# EAGLE schematic M462B Final (EAGLE 7.2.0)
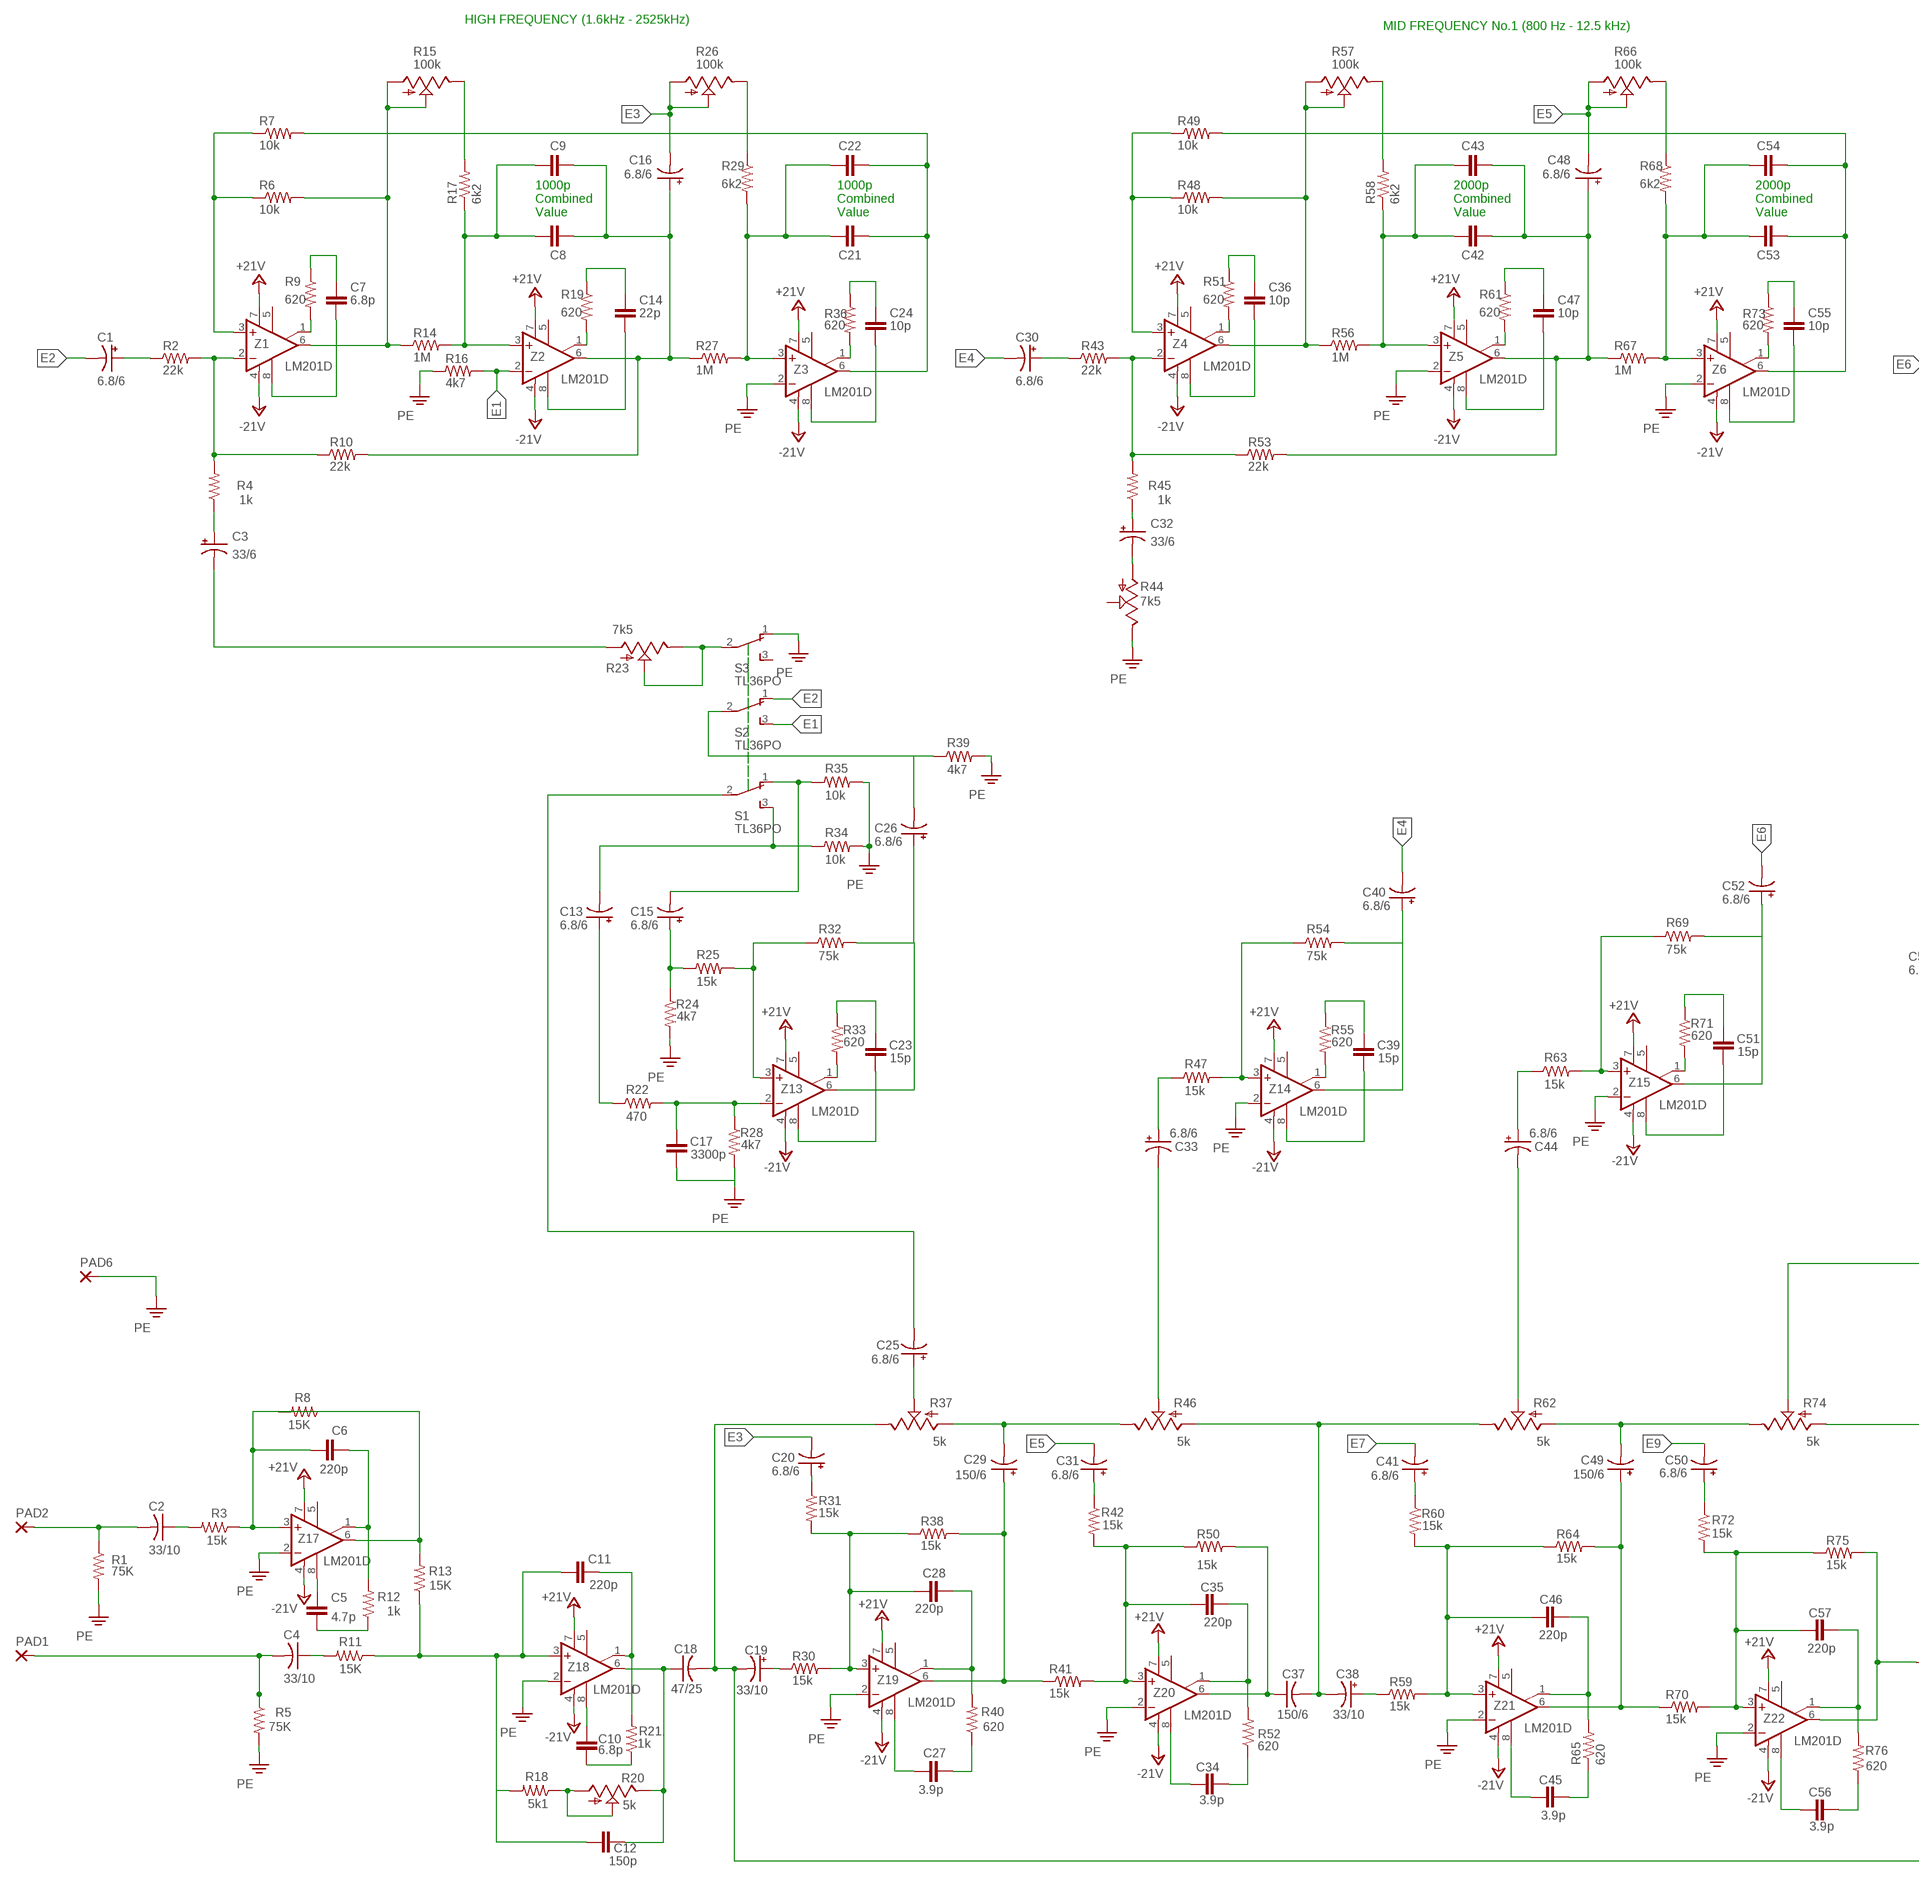
[diagram p0: schematic, sheet 1, part 1 of 2]
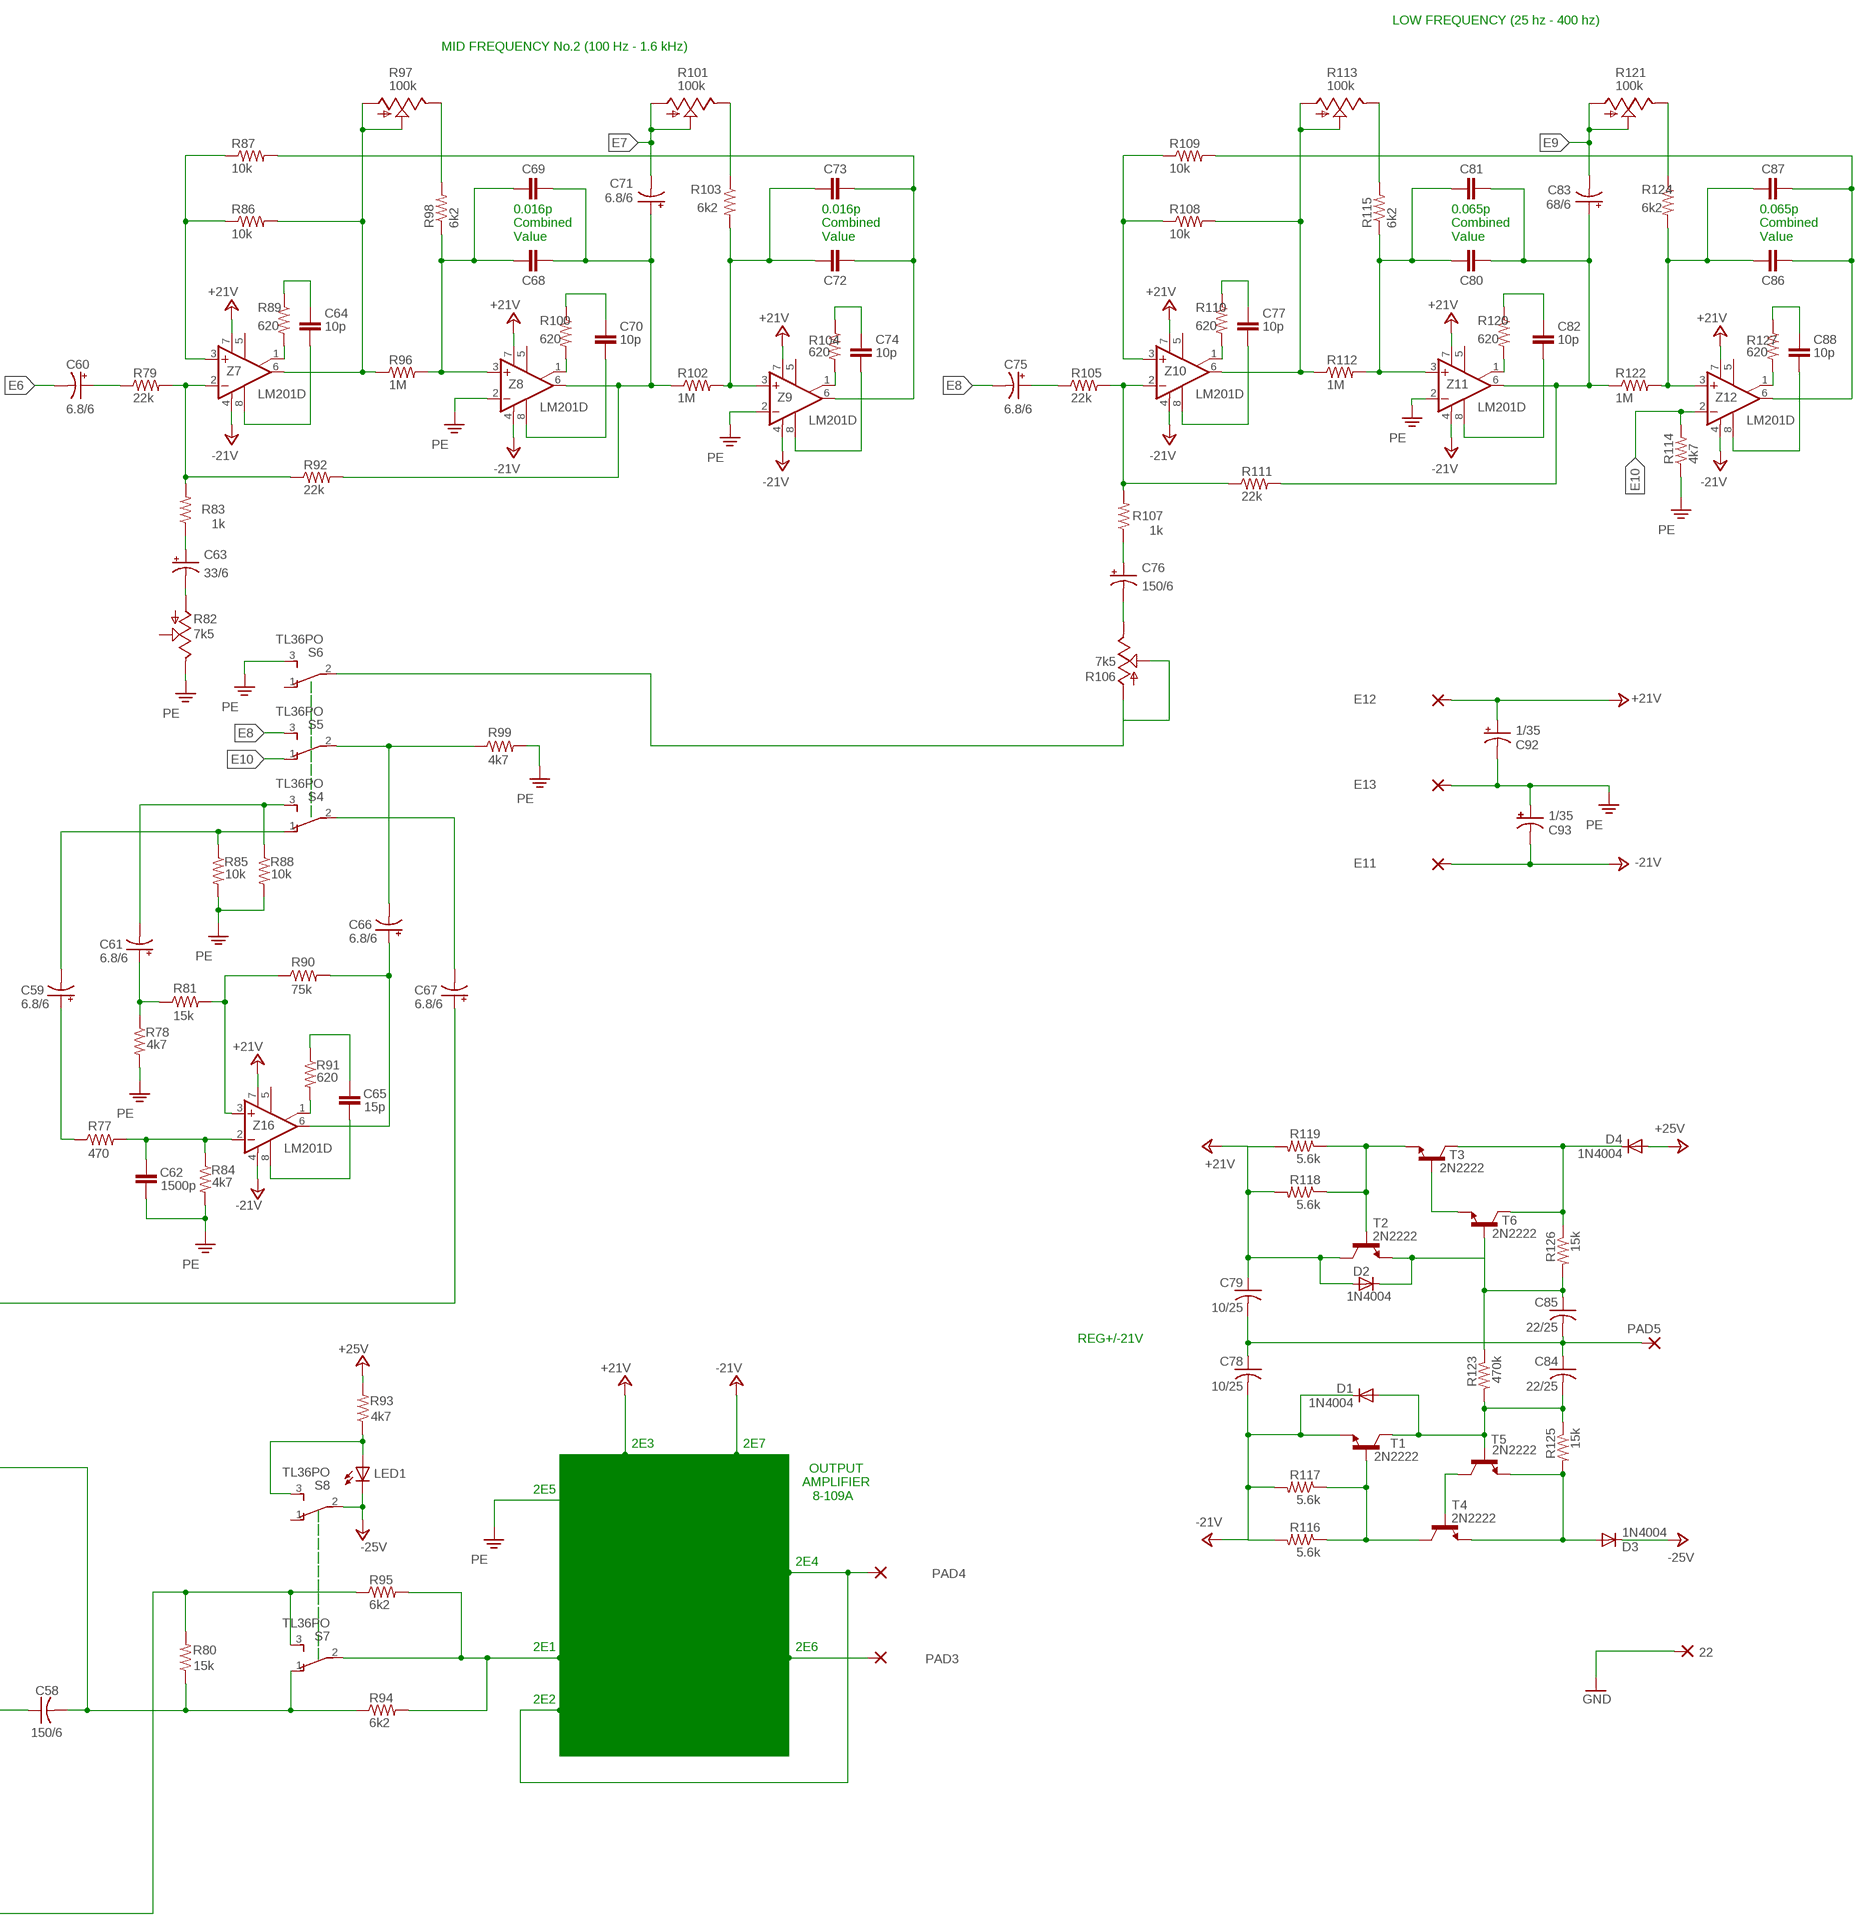
[diagram p1: schematic, sheet 1, part 2 of 2]

## Parts
22  SMD2  [SMD1,27-2,54]
C1  6.8/6  CPOL-US153CLV-0605  [153CLV-0605]
C2  33/10  C-USC0805  [C0805]
C3  33/6  CPOL-US153CLV-0605  [153CLV-0605]
C4  33/10  C-USC0805  [C0805]
C5  4.7p  C2.5/5  [C2.5-5]
C6  220p  C2.5/5  [C2.5-5]
C7  6.8p  C-EUC1206  [C1206]
C8  C-EUC1206  [C1206]
C9  C-EUC1206  [C1206]
C10  6.8p  C2.5/5  [C2.5-5]
C11  220p  C2.5/5  [C2.5-5]
C12  150p  C-EUC1206  [C1206]
C13  6.8/6  CPOL-US153CLV-0605  [153CLV-0605]
C14  22p  C-EUC1206  [C1206]
C15  6.8/6  CPOL-US153CLV-0605  [153CLV-0605]
C16  6.8/6  CPOL-US153CLV-0605  [153CLV-0605]
C17  3300p  C-EUC1206  [C1206]
C18  47/25  C-USC0805  [C0805]
C19  33/10  CPOL-US153CLV-0605  [153CLV-0605]
C20  6.8/6  CPOL-US153CLV-0605  [153CLV-0605]
C21  C-EUC1206  [C1206]
C22  C-EUC1206  [C1206]
C23  15p  C-EUC1206  [C1206]
C24  10p  C-EUC1206  [C1206]
C25  6.8/6  CPOL-US153CLV-0605  [153CLV-0605]
C26  6.8/6  CPOL-US153CLV-0605  [153CLV-0605]
C27  3.9p  C-EUC1206  [C1206]
C28  220p  C-EUC1206  [C1206]
C29  150/6  CPOL-US153CLV-0605  [153CLV-0605]
C30  6.8/6  CPOL-US153CLV-0605  [153CLV-0605]
C31  6.8/6  CPOL-US153CLV-0605  [153CLV-0605]
C32  33/6  CPOL-US153CLV-0605  [153CLV-0605]
C33  6.8/6  CPOL-US153CLV-0605  [153CLV-0605]
C34  3.9p  C-EUC1206  [C1206]
C35  220p  C-EUC1206  [C1206]
C36  10p  C-EUC1206  [C1206]
C37  150/6  C-USC0805  [C0805]
C38  33/10  CPOL-US153CLV-0605  [153CLV-0605]
C39  15p  C-EUC1206  [C1206]
C40  6.8/6  CPOL-US153CLV-0605  [153CLV-0605]
C41  6.8/6  CPOL-US153CLV-0605  [153CLV-0605]
C42  C-EUC1206  [C1206]
C43  C-EUC1206  [C1206]
C44  6.8/6  CPOL-US153CLV-0605  [153CLV-0605]
C45  3.9p  C-EUC1206  [C1206]
C46  220p  C-EUC1206  [C1206]
C47  10p  C-EUC1206  [C1206]
C48  6.8/6  CPOL-US153CLV-0605  [153CLV-0605]
C49  150/6  CPOL-US153CLV-0605  [153CLV-0605]
C50  6.8/6  CPOL-US153CLV-0605  [153CLV-0605]
C51  15p  C-EUC1206  [C1206]
C52  6.8/6  CPOL-US153CLV-0605  [153CLV-0605]
C53  C-EUC1206  [C1206]
C54  C-EUC1206  [C1206]
C55  10p  C-EUC1206  [C1206]
C56  3.9p  C-EUC1206  [C1206]
C57  220p  C-EUC1206  [C1206]
C58  150/6  C-USC0805  [C0805]
C59  6.8/6  CPOL-US153CLV-0605  [153CLV-0605]
C60  6.8/6  CPOL-US153CLV-0605  [153CLV-0605]
C61  6.8/6  CPOL-US153CLV-0605  [153CLV-0605]
C62  1500p  C-EUC1206  [C1206]
C63  33/6  CPOL-US153CLV-0605  [153CLV-0605]
C64  10p  C-EUC1206  [C1206]
C65  15p  C-EUC1206  [C1206]
C66  6.8/6  CPOL-US153CLV-0605  [153CLV-0605]
C67  6.8/6  CPOL-US153CLV-0605  [153CLV-0605]
C68  C-EUC1206  [C1206]
C69  C-EUC1206  [C1206]
C70  10p  C-EUC1206  [C1206]
C71  6.8/6  CPOL-US153CLV-0605  [153CLV-0605]
C72  C-EUC1206  [C1206]
C73  C-EUC1206  [C1206]
C74  10p  C-EUC1206  [C1206]
C75  6.8/6  CPOL-US153CLV-0605  [153CLV-0605]
C76  150/6  CPOL-US153CLV-0605  [153CLV-0605]
C77  10p  C-EUC1206  [C1206]
C78  10/25  C-USC0805  [C0805]
C79  10/25  C-USC0805  [C0805]
C80  C-EUC1206  [C1206]
C81  C-EUC1206  [C1206]
C82  10p  C-EUC1206  [C1206]
C83  68/6  CPOL-US153CLV-0605  [153CLV-0605]
C84  22/25  C-USC0805  [C0805]
C85  22/25  C-USC0805  [C0805]
C86  C-EUC1206  [C1206]
C87  C-EUC1206  [C1206]
C88  10p  C-EUC1206  [C1206]
C92  1/35  CPOL-US153CLV-0605  [153CLV-0605]
C93  1/35  CPOL-US153CLV-0605  [153CLV-0605]
D1  1N4004  [DO41-10]
D2  1N4004  [DO41-10]
D3  1N4004  [DO41-10]
D4  1N4004  [DO41-10]
E11  SMD2  [SMD1,27-2,54]
E12  SMD2  [SMD1,27-2,54]
E13  SMD2  [SMD1,27-2,54]
LED1  TLLR4400  [LED3MM]
PAD1  SMD2  [SMD1,27-2,54]
PAD2  SMD2  [SMD1,27-2,54]
PAD3  SMD2  [SMD1,27-2,54]
PAD4  SMD2  [SMD1,27-2,54]
PAD5  SMD2  [SMD1,27-2,54]
PAD6  SMD2  [SMD1,27-2,54]
R1  75K  R-US_R0805  [R0805]
R2  22k  R-US_M1206  [M1206]
R3  15k  R-US_R0805  [R0805]
R4  1k  R-US_M1206  [M1206]
R5  75K  R-US_R0805  [R0805]
R6  10k  R-US_M1206  [M1206]
R7  10k  R-US_M1206  [M1206]
R8  15K  R-US_R0805  [R0805]
R9  620  R-US_M1206  [M1206]
R10  22k  R-US_M1206  [M1206]
R11  15K  R-US_R0805  [R0805]
R12  1k  R-US_R0805  [R0805]
R13  15K  R-US_R0805  [R0805]
R14  1M  R-US_M1206  [M1206]
R15  100k  TRIM_US-B25V  [B25V]
R16  4k7  R-US_M1206  [M1206]
R17  6k2  R-US_M1206  [M1206]
R18  5k1  R-US_R0805  [R0805]
R19  620  R-US_M1206  [M1206]
R20  5k  TRIM_US-B25V  [B25V]
R21  1k  R-US_R0805  [R0805]
R22  470  R-US_M1206  [M1206]
R23  7k5  TRIM_US-B25V  [B25V]
R24  4k7  R-US_M1206  [M1206]
R25  15k  R-US_M1206  [M1206]
R26  100k  TRIM_US-B25V  [B25V]
R27  1M  R-US_M1206  [M1206]
R28  4k7  R-US_M1206  [M1206]
R29  6k2  R-US_M1206  [M1206]
R30  15k  R-US_M1206  [M1206]
R31  15k  R-US_M1206  [M1206]
R32  75k  R-US_M1206  [M1206]
R33  620  R-US_M1206  [M1206]
R34  10k  R-US_M1206  [M1206]
R35  10k  R-US_M1206  [M1206]
R36  620  R-US_M1206  [M1206]
R37  5k  TRIM_US-B25V  [B25V]
R38  15k  R-US_M1206  [M1206]
R39  4k7  R-US_M1206  [M1206]
R40  620  R-US_M1206  [M1206]
R41  15k  R-US_M1206  [M1206]
R42  15k  R-US_M1206  [M1206]
R43  22k  R-US_M1206  [M1206]
R44  7k5  TRIM_US-B25V  [B25V]
R45  1k  R-US_M1206  [M1206]
R46  5k  TRIM_US-B25V  [B25V]
R47  15k  R-US_M1206  [M1206]
R48  10k  R-US_M1206  [M1206]
R49  10k  R-US_M1206  [M1206]
R50  15k  R-US_M1206  [M1206]
R51  620  R-US_M1206  [M1206]
R52  620  R-US_M1206  [M1206]
R53  22k  R-US_M1206  [M1206]
R54  75k  R-US_M1206  [M1206]
R55  620  R-US_M1206  [M1206]
R56  1M  R-US_M1206  [M1206]
R57  100k  TRIM_US-B25V  [B25V]
R58  6k2  R-US_M1206  [M1206]
R59  15k  R-US_M1206  [M1206]
R60  15k  R-US_M1206  [M1206]
R61  620  R-US_M1206  [M1206]
R62  5k  TRIM_US-B25V  [B25V]
R63  15k  R-US_M1206  [M1206]
R64  15k  R-US_M1206  [M1206]
R65  620  R-US_M1206  [M1206]
R66  100k  TRIM_US-B25V  [B25V]
R67  1M  R-US_M1206  [M1206]
R68  6k2  R-US_M1206  [M1206]
R69  75k  R-US_M1206  [M1206]
R70  15k  R-US_M1206  [M1206]
R71  620  R-US_M1206  [M1206]
R72  15k  R-US_M1206  [M1206]
R73  620  R-US_M1206  [M1206]
R74  5k  TRIM_US-B25V  [B25V]
R75  15k  R-US_M1206  [M1206]
R76  620  R-US_M1206  [M1206]
R77  470  R-US_M1206  [M1206]
R78  4k7  R-US_M1206  [M1206]
R79  22k  R-US_M1206  [M1206]
R80  15k  R-US_M1206  [M1206]
R81  15k  R-US_M1206  [M1206]
R82  7k5  TRIM_US-B25V  [B25V]
R83  1k  R-US_M1206  [M1206]
R84  4k7  R-US_M1206  [M1206]
R85  10k  R-US_M1206  [M1206]
R86  10k  R-US_M1206  [M1206]
R87  10k  R-US_M1206  [M1206]
R88  10k  R-US_M1206  [M1206]
R89  620  R-US_M1206  [M1206]
R90  75k  R-US_M1206  [M1206]
R91  620  R-US_M1206  [M1206]
R92  22k  R-US_M1206  [M1206]
R93  4k7  R-US_M1206  [M1206]
R94  6k2  R-US_M1206  [M1206]
R95  6k2  R-US_M1206  [M1206]
R96  1M  R-US_M1206  [M1206]
R97  100k  TRIM_US-B25V  [B25V]
R98  6k2  R-US_M1206  [M1206]
R99  4k7  R-US_M1206  [M1206]
R100  620  R-US_M1206  [M1206]
R101  100k  TRIM_US-B25V  [B25V]
R102  1M  R-US_M1206  [M1206]
R103  6k2  R-US_M1206  [M1206]
R104  620  R-US_M1206  [M1206]
R105  22k  R-US_M1206  [M1206]
R106  7k5  TRIM_US-B25V  [B25V]
R107  1k  R-US_M1206  [M1206]
R108  10k  R-US_M1206  [M1206]
R109  10k  R-US_M1206  [M1206]
R110  620  R-US_M1206  [M1206]
R111  22k  R-US_M1206  [M1206]
R112  1M  R-US_M1206  [M1206]
R113  100k  TRIM_US-B25V  [B25V]
R114  4k7  R-US_M1206  [M1206]
R115  6k2  R-US_M1206  [M1206]
R116  5.6k  R-US_R0805  [R0805]
R117  5.6k  R-US_R0805  [R0805]
R118  5.6k  R-US_R0805  [R0805]
R119  5.6k  R-US_R0805  [R0805]
R120  620  R-US_M1206  [M1206]
R121  100k  TRIM_US-B25V  [B25V]
R122  1M  R-US_M1206  [M1206]
R123  470k  R-US_R0805  [R0805]
R124  6k2  R-US_M1206  [M1206]
R125  15k  R-US_R0805  [R0805]
R126  15k  R-US_R0805  [R0805]
R127  620  R-US_M1206  [M1206]
S1  TL36PO  [TL3XPO]
S2  TL36PO  [TL3XPO]
S3  TL36PO  [TL3XPO]
S4  TL36PO  [TL3XPO]
S5  TL36PO  [TL3XPO]
S6  TL36PO  [TL3XPO]
S7  TL36PO  [TL3XPO]
S8  TL36PO  [TL3XPO]
T1  2N2222  [TO92-EBC-OVAL]
T2  2N2222  [TO92-EBC-OVAL]
T3  2N2222  [TO92-EBC-OVAL]
T4  2N2222  [TO92-EBC-OVAL]
T5  2N2222  [TO92-EBC-OVAL]
T6  2N2222  [TO92-EBC-OVAL]
Z1  LM201D  [SO08]
Z2  LM201D  [SO08]
Z3  LM201D  [SO08]
Z4  LM201D  [SO08]
Z5  LM201D  [SO08]
Z6  LM201D  [SO08]
Z7  LM201D  [SO08]
Z8  LM201D  [SO08]
Z9  LM201D  [SO08]
Z10  LM201D  [SO08]
Z11  LM201D  [SO08]
Z12  LM201D  [SO08]
Z13  LM201D  [SO08]
Z14  LM201D  [SO08]
Z15  LM201D  [SO08]
Z16  LM201D  [SO08]
Z17  LM201D  [SO08]
Z18  LM201D  [SO08]
Z19  LM201D  [SO08]
Z20  LM201D  [SO08]
Z21  LM201D  [SO08]
Z22  LM201D  [SO08]

## Nets
2E1: R94.2 R95.2 S7.2(P)
2E2: PAD4.1(P)
2E6: PAD3.1(P)
+24V: C79.1 C92.+ D2.A D4.A E12.1(P) LED1.K(C) R93.2 R118.2 R119.2 S8.2(P) T2.C Z17.7(V+) Z18.7(V+) ; supply symbol labelled +21V, +25V, -25V
-24V: C78.2 C93.- D1.C D3.C E11.1(P) R116.2 R117.2 T1.E Z1.4(V-) Z2.4(V-) Z3.4(V-) Z4.4(V-) Z5.4(V-) Z6.4(V-) Z7.4(V-) Z8.4(V-) Z9.4(V-) Z10.4(V-) Z11.4(V-) Z12.4(V-) Z13.4(V-) Z14.4(V-) Z15.4(V-) Z16.4(V-) Z17.4(V-) Z18.4(V-) Z19.4(V-) Z20.4(V-) Z21.4(V-) Z22.4(V-) ; supply symbol labelled -21V, -25V
E1: R16.2 S2.3(S) Z2.2(-IN)
E2: C1.- S2.1(O)
E3: C16.- C20.- R26.A R26.S
E4: C30.- C40.-
E5: C31.- C48.- R66.A R66.S
E6: C52.- C60.-
E7: C41.- C71.- R101.A R101.S
E8: C75.- S5.3(S)
E9: C50.- C83.- R121.A R121.S
E10: R114.2 S5.1(O) Z12.2(-IN)
GND: 22.1(P)
N$7: C5.1 Z17.8(CMP)
N$8: C6.1 R12.2 Z17.1(ON/CMP)
N$9: C5.2 R12.1
N$10: C10.1 Z18.8(CMP)
N$11: C11.1 R21.2 Z18.1(ON/CMP)
N$12: C10.2 R21.1
N$13: C11.2 C12.1 R11.1 R13.1 R18.2 Z18.3(+IN)
N$14: C2.1 R3.2
N$15: C6.2 R3.1 R8.1 R8.2 R13.2 Z17.3(+IN) Z17.6(OUT)
N$16: C4.1 R11.2
N$17: C12.2 C18.1 R20.E Z18.6(OUT)
N$18: C4.2 PAD1.1(P) R5.1
N$19: C29.+ R38.2 R41.1 Z19.6(OUT)
N$20: R18.1 R20.A R20.S
N$21: C37.1 R50.2 Z20.6(OUT)
N$22: C28.1 R30.2 R31.2 R38.1 Z19.3(+IN)
N$23: R51.2 Z4.1(ON/CMP)
N$24: C27.1 Z19.8(CMP)
N$25: C27.2 R40.1
N$26: C19.+ R30.1
N$27: C18.2 C19.- R37.E R80.2 R95.1 S7.3(S)
N$28: C20.+ R31.1
N$30: C35.1 R41.2 R42.2 R50.1 Z20.3(+IN)
N$31: C34.1 Z20.8(CMP)
N$32: C34.2 R52.1
N$33: C35.2 R52.2 Z20.1(ON/CMP)
N$34: C28.2 R40.2 Z19.1(ON/CMP)
N$35: R9.2 Z1.1(ON/CMP)
N$36: C7.1 R9.1
N$37: C7.2 Z1.8(CMP)
N$38: C49.+ R64.2 R70.1 Z21.6(OUT)
N$39: R6.1 R7.1 Z1.3(+IN)
N$40: R2.2 R4.2 R10.1 Z1.2(-IN)
N$41: C36.1 R51.1
N$43: R118.1 R119.1 T2.B T3.E
N$44: D4.C R126.1 T3.C T6.C
N$45: T3.B T6.E
N$46: C85.1 D2.C R123.1 R126.2 T2.E T6.B
N$47: T4.B T5.C
N$48: D3.A R125.2 T4.E T5.E
N$49: R19.2 Z2.1(ON/CMP)
N$50: C14.1 R19.1
N$51: C14.2 Z2.8(CMP)
N$53: C84.2 D1.A R123.2 R125.1 T1.C T5.B
N$54: R116.1 R117.1 T1.B T4.C
N$55: C8.2 C9.2 C16.+ R10.2 R27.1 Z2.6(OUT)
N$56: C8.1 C9.1 R14.2 R17.1 Z2.3(+IN)
N$57: C46.1 R59.2 R60.2 R64.1 Z21.3(+IN)
N$58: R6.2 R14.1 R15.A R15.S Z1.6(OUT)
N$59: C1.+ R2.1
N$60: R15.E R17.2
N$61: C3.+ R4.1
N$62: R36.2 Z3.1(ON/CMP)
N$63: C24.1 R36.1
N$64: C24.2 Z3.8(CMP)
N$65: C21.2 C22.2 R7.2 Z3.6(OUT)
N$66: C21.1 C22.1 R27.2 R29.2 Z3.3(+IN)
N$67: R26.E R29.1
N$68: C45.1 Z21.8(CMP)
N$69: C45.2 R65.1
N$70: C46.2 R65.2 Z21.1(ON/CMP)
N$71: C31.+ R42.1
N$72: C56.1 Z22.8(CMP)
N$73: C56.2 R76.1
N$74: C57.2 R76.2 Z22.1(ON/CMP)
N$75: C58.1 R75.2 Z22.6(OUT)
N$76: C57.1 R70.2 R72.2 R75.1 Z22.3(+IN)
N$77: C41.+ R60.1
N$78: C37.2 C38.- R46.A R62.E
N$79: C38.+ R59.1
N$80: C58.2 R74.A R80.1 R94.1 S7.1(O)
N$81: C50.+ R72.1
N$82: C29.- R37.A R46.E
N$83: C26.+ R32.2 Z13.6(OUT)
N$84: C49.- R62.A R74.E
N$85: C36.2 Z4.8(CMP)
N$86: R48.1 R49.1 Z4.3(+IN)
N$87: R43.2 R45.2 R53.1 Z4.2(-IN)
N$88: R61.2 Z5.1(ON/CMP)
N$89: C47.1 R61.1
N$90: C47.2 Z5.8(CMP)
N$91: C42.2 C43.2 C48.+ R53.2 R67.1 Z5.6(OUT)
N$92: C42.1 C43.1 R56.2 R58.1 Z5.3(+IN)
N$93: C30.+ R43.1
N$94: R48.2 R56.1 R57.A R57.S Z4.6(OUT)
N$95: R57.E R58.2
N$96: C32.+ R45.1
N$97: R73.2 Z6.1(ON/CMP)
N$98: C55.1 R73.1
N$99: C55.2 Z6.8(CMP)
N$100: C53.2 C54.2 R49.2 Z6.6(OUT)
N$101: C53.1 C54.1 R67.2 R68.2 Z6.3(+IN)
N$102: R66.E R68.1
N$103: R89.2 Z7.1(ON/CMP)
N$104: C64.1 R89.1
N$105: C64.2 Z7.8(CMP)
N$106: R86.1 R87.1 Z7.3(+IN)
N$107: R79.2 R83.2 R92.1 Z7.2(-IN)
N$108: R100.2 Z8.1(ON/CMP)
N$109: C70.1 R100.1
N$110: C70.2 Z8.8(CMP)
N$111: C68.2 C69.2 C71.+ R92.2 R102.1 Z8.6(OUT)
N$112: C68.1 C69.1 R96.2 R98.1 Z8.3(+IN)
N$113: C60.+ R79.1
N$114: R86.2 R96.1 R97.A R97.S Z7.6(OUT)
N$115: R97.E R98.2
N$116: C63.+ R83.1
N$117: R104.2 Z9.1(ON/CMP)
N$118: C74.1 R104.1
N$119: C74.2 Z9.8(CMP)
N$120: C72.2 C73.2 R87.2 Z9.6(OUT)
N$121: C72.1 C73.1 R102.2 R103.2 Z9.3(+IN)
N$122: R101.E R103.1
N$123: R110.2 Z10.1(ON/CMP)
N$124: C77.1 R110.1
N$125: C77.2 Z10.8(CMP)
N$126: R108.1 R109.1 Z10.3(+IN)
N$127: R105.2 R107.2 R111.1 Z10.2(-IN)
N$128: R120.2 Z11.1(ON/CMP)
N$129: C82.1 R120.1
N$130: C82.2 Z11.8(CMP)
N$131: C80.2 C81.2 C83.+ R111.2 R122.1 Z11.6(OUT)
N$132: C80.1 C81.1 R112.2 R115.1 Z11.3(+IN)
N$133: C75.+ R105.1
N$134: R108.2 R112.1 R113.A R113.S Z10.6(OUT)
N$135: R113.E R115.2
N$136: C76.+ R107.1
N$137: R127.2 Z12.1(ON/CMP)
N$138: C88.1 R127.1
N$139: C88.2 Z12.8(CMP)
N$140: C86.2 C87.2 R109.2 Z12.6(OUT)
N$141: C86.1 C87.1 R122.2 R124.2 Z12.3(+IN)
N$142: R121.E R124.1
N$143: R33.2 Z13.1(ON/CMP)
N$144: C23.1 R33.1
N$145: C23.2 Z13.8(CMP)
N$146: R25.2 R32.1 Z13.3(+IN)
N$147: R55.2 Z14.1(ON/CMP)
N$148: C39.1 R55.1
N$149: C39.2 Z14.8(CMP)
N$150: C40.+ R54.2 Z14.6(OUT)
N$151: R47.2 R54.1 Z14.3(+IN)
N$152: R71.2 Z15.1(ON/CMP)
N$153: C51.1 R71.1
N$154: C51.2 Z15.8(CMP)
N$155: C52.+ R69.2 Z15.6(OUT)
N$156: R63.2 R69.1 Z15.3(+IN)
N$157: R91.2 Z16.1(ON/CMP)
N$158: C65.1 R91.1
N$159: C65.2 Z16.8(CMP)
N$160: C66.+ R90.2 Z16.6(OUT)
N$161: R81.2 R90.1 Z16.3(+IN)
N$162: C17.1 R22.2 R28.1 Z13.2(-IN)
N$163: C15.+ R24.1 R25.1
N$164: C13.+ R22.1
N$165: C13.- R34.1 S1.3(S)
N$166: C15.- R35.1 S1.1(O)
N$167: C25.+ R37.S
N$168: C25.- S1.2(P)
N$169: C26.- R39.1 S2.2(P)
N$170: R23.E R23.S S3.2(P)
N$171: C3.- R23.A
N$172: C32.- R44.A
N$173: C33.- R46.S
N$174: C33.+ R47.1
N$175: C44.+ R63.1
N$176: C44.- R62.S
N$177: R106.A R106.S S6.2(P)
N$178: C76.- R106.E
N$179: C63.- R82.A
N$180: C62.1 R77.2 R84.1 Z16.2(-IN)
N$181: C59.+ R77.1
N$182: C2.2 PAD2.1(P) R1.1
N$183: C59.- R85.1 S4.1(O)
N$184: C66.- R99.1 S5.2(P)
N$185: C67.+ R74.S
N$186: C67.- S4.2(P)
N$187: C61.+ R78.1 R81.1
N$188: C61.- R88.1 S4.3(S)
N$189: LED1.A R93.1 S8.3(S)
N$190: C78.1 C79.2 C84.1 C85.2 PAD5.1(P)
PE: C17.2 C62.2 C92.- C93.+ E13.1(P) PAD6.1(P) R1.2 R5.2 R16.1 R24.2 R28.2 R34.2 R35.2 R39.2 R44.E R78.2 R82.E R84.2 R85.2 R88.2 R99.2 R114.1 S3.1(O) S6.3(S) Z3.2(-IN) Z5.2(-IN) Z6.2(-IN) Z8.2(-IN) Z9.2(-IN) Z11.2(-IN) Z14.2(-IN) Z15.2(-IN) Z17.2(-IN) Z18.2(-IN) Z19.2(-IN) Z20.2(-IN) Z21.2(-IN) Z22.2(-IN)
VCC: Z1.7(V+) Z2.7(V+) Z3.7(V+) Z4.7(V+) Z5.7(V+) Z6.7(V+) Z7.7(V+) Z8.7(V+) Z9.7(V+) Z10.7(V+) Z11.7(V+) Z12.7(V+) Z13.7(V+) Z14.7(V+) Z15.7(V+) Z16.7(V+) Z19.7(V+) Z20.7(V+) Z21.7(V+) Z22.7(V+) ; supply symbol labelled +21V
Unconnected: R44.S R82.S S3.3(S) S6.1(O) S8.1(O) Z1.5(ON) Z2.5(ON) Z3.5(ON) Z4.5(ON) Z5.5(ON) Z6.5(ON) Z7.5(ON) Z8.5(ON) Z9.5(ON) Z10.5(ON) Z11.5(ON) Z12.5(ON) Z13.5(ON) Z14.5(ON) Z15.5(ON) Z16.5(ON) Z17.5(ON) Z18.5(ON) Z19.5(ON) Z20.5(ON) Z21.5(ON) Z22.5(ON)

## Notes on the sheet
- LOW FREQUENCY (25 hz - 400 hz)
- HIGH FREQUENCY (1.6kHz - 2525kHz)
- MID FREQUENCY No.1 (800 Hz - 12.5 kHz)
- MID FREQUENCY No.2 (100 Hz - 1.6 kHz)
- 1000p 
  Combined 
  Value
- 1000p 
  Combined 
  Value
- 2000p 
  Combined 
  Value
- 2000p 
  Combined 
  Value
- 0.016p 
  Combined 
  Value
- 0.016p 
  Combined 
  Value
- 0.065p 
  Combined 
  Value
- 0.065p 
  Combined 
  Value
- |
  |
  |
  |
  |
  |
  |
  |
  |
  |
- |
  |
  |
  |
  |
  |
  |
  |
  |
  |
  |
- REG+/-21V
- 2E3 | 2E7
- 2E5
- OUTPUT
  AMPLIFIER
     8-109A
- 2E4
- OUTPUT
  AMPLIFIER
  8-109A
- OUTPUT
  AMPLIFIER
  8-109A
- OUTPUT
  AMPLIFIER
  8-109A
- 2E1 | 2E6
- |
  |
  |
  |
  |
  |
  |
  |
  |
  |
  |
- 2E2

## Library data of the parts
22 E11-E13 PAD1-PAD6 = wirepad:SMD2: SMD PAD
C1 C3 C13 C15 C16 C19 C20 C25 C26 C29-C33 C38 C40 C41 C44 C48-C50 C52 C59-C61 C63 C66 C67 C71 C75 C76 C83 C92 C93 = rcl:CPOL-US: POLARIZED CAPACITOR, American symbol
C2 C4 C18 C37 C58 C78 C79 C84 C85 = adafruit:C-US: CAPACITOR, American symbol
C5 C6 C10 C11 = capacitor-wima:C: CAPACITOR naming: grid - package width
C7-C9 C12 C14 C17 C21-C24 C27 C28 C34-C36 C39 C42 C43 C45-C47 C51 C53-C57 C62 C64 C65 C68-C70 C72-C74 C77 C80-C82 C86-C88 = rcl:C-EU: CAPACITOR, European symbol
D1-D4 = adafruit:1N4004: DIODE General purpose 1N400x type rectifier (With bigger pads) http://www.ladyada.net/library/pcb/eaglelibrary.html
LED1 = led:TLLR4400: Low Current (2mA) LED 3 mm Tinted Diffused Package color RED Source: Data sheet <http://www.farnell.com/datasheets/391100.pdf>; MF: VISHAY SEMICONDUCTOR; OC_FARNELL: 1612437
R1 R3 R5 R8 R11-R13 R18 R21 R116-R119 R123 R125 R126 = adafruit:R-US_: RESISTOR, American symbol
R2 R4 R6 R7 R9 R10 R14 R16 R17 R19 R22 R24 R25 R27-R36 R38-R43 R45 R47-R56 R58-R61 R63-R65 R67-R73 R75-R81 R83-R96 R98-R100 R102-R105 R107-R112 R114 R115 R120 R122 R124 R127 = resistor:R-US_: RESISTOR, American symbol
R15 R20 R23 R26 R37 R44 R46 R57 R62 R66 R74 R82 R97 R101 R106 R113 R121 = pot:TRIM_US-: POTENTIOMETER
S1-S8 = switch:TL36PO: TINY SWITCH ON - ON Source: http://www2.produktinfo.conrad.com/datenblaetter/700000-724999/705152-da-01-de-Subminiaturschalter_TL_36YO.pdf
T1-T6 = adafruit:2N2222: NPN TRANSISTOR Big oval pads
Z1-Z22 = linear:LM201: OP AMP